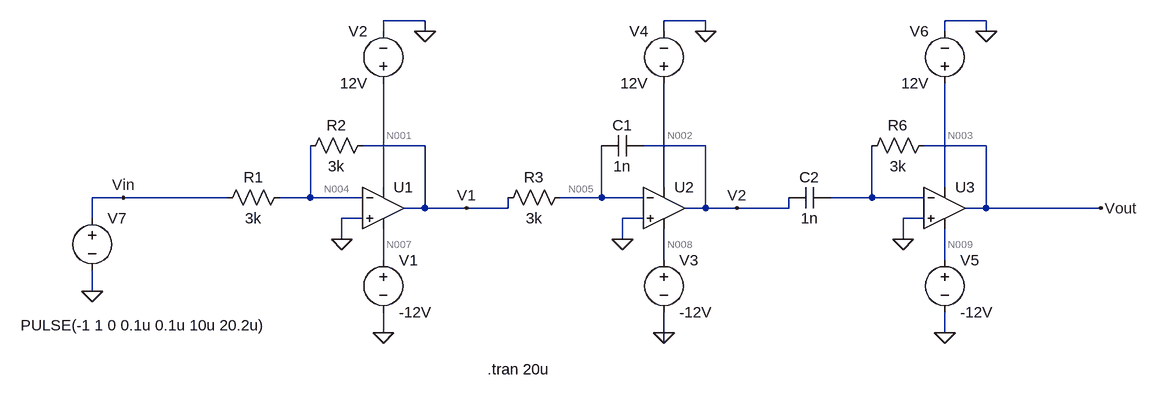
[diagram p0: schematic PID_opamps.asc]
PID_opamps.asc, the LTspice schematic file:
Version 4
SHEET 1 984 680
WIRE -304 -160 -368 -160
WIRE 128 -160 64 -160
WIRE 560 -160 496 -160
WIRE -368 -144 -368 -160
WIRE -304 -144 -304 -160
WIRE 64 -144 64 -160
WIRE 128 -144 128 -160
WIRE 496 -144 496 -160
WIRE 560 -144 560 -160
WIRE -304 32 -400 32
WIRE 128 32 32 32
WIRE 560 32 464 32
WIRE -368 96 -368 -64
WIRE 64 96 64 -64
WIRE 496 96 496 -64
WIRE -768 112 -816 112
WIRE -608 112 -768 112
WIRE -480 112 -480 32
WIRE -480 112 -528 112
WIRE -400 112 -480 112
WIRE -32 112 -32 32
WIRE -32 112 -96 112
WIRE 32 112 -32 112
WIRE 384 112 384 32
WIRE 384 112 320 112
WIRE 464 112 384 112
WIRE -304 128 -304 32
WIRE -304 128 -336 128
WIRE -240 128 -304 128
WIRE -176 128 -176 112
WIRE -176 128 -240 128
WIRE 128 128 128 32
WIRE 128 128 96 128
WIRE 176 128 128 128
WIRE 256 128 256 112
WIRE 256 128 176 128
WIRE 560 128 560 32
WIRE 560 128 528 128
WIRE 736 128 560 128
WIRE -816 144 -816 112
WIRE -400 144 -432 144
WIRE 32 144 0 144
WIRE 464 144 432 144
WIRE -432 176 -432 144
WIRE 0 176 0 144
WIRE 432 176 432 144
WIRE -368 208 -368 160
WIRE 64 208 64 160
WIRE 496 208 496 160
WIRE -816 256 -816 224
WIRE -368 320 -368 288
WIRE 64 320 64 288
WIRE 496 320 496 288
WIRE 64 336 64 320
FLAG -432 176 0
FLAG 0 176 0
FLAG 432 176 0
FLAG 496 320 0
FLAG 64 320 0
FLAG -368 320 0
FLAG -304 -144 0
FLAG 128 -144 0
FLAG 560 -144 0
FLAG -816 256 0
FLAG -768 112 Vin
FLAG -240 128 V1
FLAG 176 128 V2
FLAG 736 128 Vout
SYMBOL Opamps\\UniversalOpamp2 -368 128 R0
SYMATTR InstName U1
SYMBOL res -512 96 R90
WINDOW 0 0 56 VBottom 2
WINDOW 3 32 56 VTop 2
SYMATTR InstName R1
SYMATTR Value 3k
SYMBOL res -384 16 R90
WINDOW 0 0 56 VBottom 2
WINDOW 3 32 56 VTop 2
SYMATTR InstName R2
SYMATTR Value 3k
SYMBOL voltage -368 192 R0
WINDOW 123 0 0 Left 0
WINDOW 39 0 0 Left 0
SYMATTR InstName V1
SYMATTR Value -12V
SYMBOL voltage -368 -48 R180
WINDOW 0 24 96 Left 2
WINDOW 3 24 16 Left 2
WINDOW 123 0 0 Left 0
WINDOW 39 0 0 Left 0
SYMATTR InstName V2
SYMATTR Value 12V
SYMBOL Opamps\\UniversalOpamp2 64 128 R0
SYMATTR InstName U2
SYMBOL res -80 96 R90
WINDOW 0 0 56 VBottom 2
WINDOW 3 32 56 VTop 2
SYMATTR InstName R3
SYMATTR Value 3k
SYMBOL voltage 64 192 R0
WINDOW 123 0 0 Left 0
WINDOW 39 0 0 Left 0
SYMATTR InstName V3
SYMATTR Value -12V
SYMBOL voltage 64 -48 R180
WINDOW 0 24 96 Left 2
WINDOW 3 24 16 Left 2
WINDOW 123 0 0 Left 0
WINDOW 39 0 0 Left 0
SYMATTR InstName V4
SYMATTR Value 12V
SYMBOL Opamps\\UniversalOpamp2 496 128 R0
SYMATTR InstName U3
SYMBOL res 480 16 R90
WINDOW 0 0 56 VBottom 2
WINDOW 3 32 56 VTop 2
SYMATTR InstName R6
SYMATTR Value 3k
SYMBOL voltage 496 192 R0
WINDOW 123 0 0 Left 0
WINDOW 39 0 0 Left 0
SYMATTR InstName V5
SYMATTR Value -12V
SYMBOL voltage 496 -48 R180
WINDOW 0 24 96 Left 2
WINDOW 3 24 16 Left 2
WINDOW 123 0 0 Left 0
WINDOW 39 0 0 Left 0
SYMATTR InstName V6
SYMATTR Value 12V
SYMBOL cap 32 16 R90
WINDOW 0 0 32 VBottom 2
WINDOW 3 32 32 VTop 2
SYMATTR InstName C1
SYMATTR Value 1n
SYMBOL cap 320 96 R90
WINDOW 0 0 32 VBottom 2
WINDOW 3 32 32 VTop 2
SYMATTR InstName C2
SYMATTR Value 1n
SYMBOL voltage -816 128 R0
WINDOW 3 -110 180 Left 2
WINDOW 123 0 0 Left 0
WINDOW 39 0 0 Left 0
SYMATTR InstName V7
SYMATTR Value PULSE(-1 1 0 0.1u 0.1u 10u 20.2u)
TEXT -208 376 Left 2 !.tran 20u

The netlist it stands for:
* PID_opamps.asc
XU1 0 N004 N001 N007 V1 level.2 Avol=1Meg GBW=10Meg Slew=10Meg ilimit=25m rail=0 Vos=0 phimargin=45 en=0 enk=0 in=0 ink=0 Rin=500Meg  ; pins IN+ IN- V+ V- OUT
R1 N004 Vin 3k
R2 V1 N004 3k
V1 N007 0 -12V
V2 N001 0 12V
XU2 0 N005 N002 N008 V2 level.2 Avol=1Meg GBW=10Meg Slew=10Meg ilimit=25m rail=0 Vos=0 phimargin=45 en=0 enk=0 in=0 ink=0 Rin=500Meg  ; pins IN+ IN- V+ V- OUT
R3 N005 V1 3k
V3 N008 0 -12V
V4 N002 0 12V
XU3 0 N006 N003 N009 Vout level.2 Avol=1Meg GBW=10Meg Slew=10Meg ilimit=25m rail=0 Vos=0 phimargin=45 en=0 enk=0 in=0 ink=0 Rin=500Meg  ; pins IN+ IN- V+ V- OUT
R6 Vout N006 3k
V5 N009 0 -12V
V6 N003 0 12V
C1 V2 N005 1n
C2 N006 V2 1n
V7 Vin 0 PULSE(-1 1 0 0.1u 0.1u 10u 20.2u)
.tran 20u
.lib UniversalOpamps2.sub
.backanno
.end

* Results of the author's LTspice run, read from the files saved beside the schematic
* Operating Point, zero values left out:
*   V(v1) = 1 V
*   V(n001) = 12 V
*   V(n007) = -12 V
*   V(n004) = -1.005 µV
*   V(vin) = -1 V
*   V(v2) = -12 V
*   V(n002) = 12 V
*   V(n008) = -12 V
*   V(n005) = 1 V
*   V(n003) = 12 V
*   V(n009) = -12 V
*   I(R3) = -2 nA
*   I(R2) = 333.3 µA
*   I(R1) = 333.3 µA
*   I(V7) = 333.3 µA
*   I(V6) = -1.199 mA
*   I(V5) = 1.199 mA
*   I(V4) = -2.789 µA
*   I(V3) = 2.621 µA
*   I(V2) = -1.373 mA
*   I(V1) = 1.04 mA
*   Ix(u1:3) = 1.373 mA
*   Ix(u1:4) = -1.04 mA
*   Ix(u1:5) = -333.3 µA
*   Ix(u2:2) = 2 nA
*   Ix(u2:3) = 2.789 µA
*   Ix(u2:4) = -2.621 µA
*   Ix(u3:3) = 1.199 mA
*   Ix(u3:4) = -1.199 mA